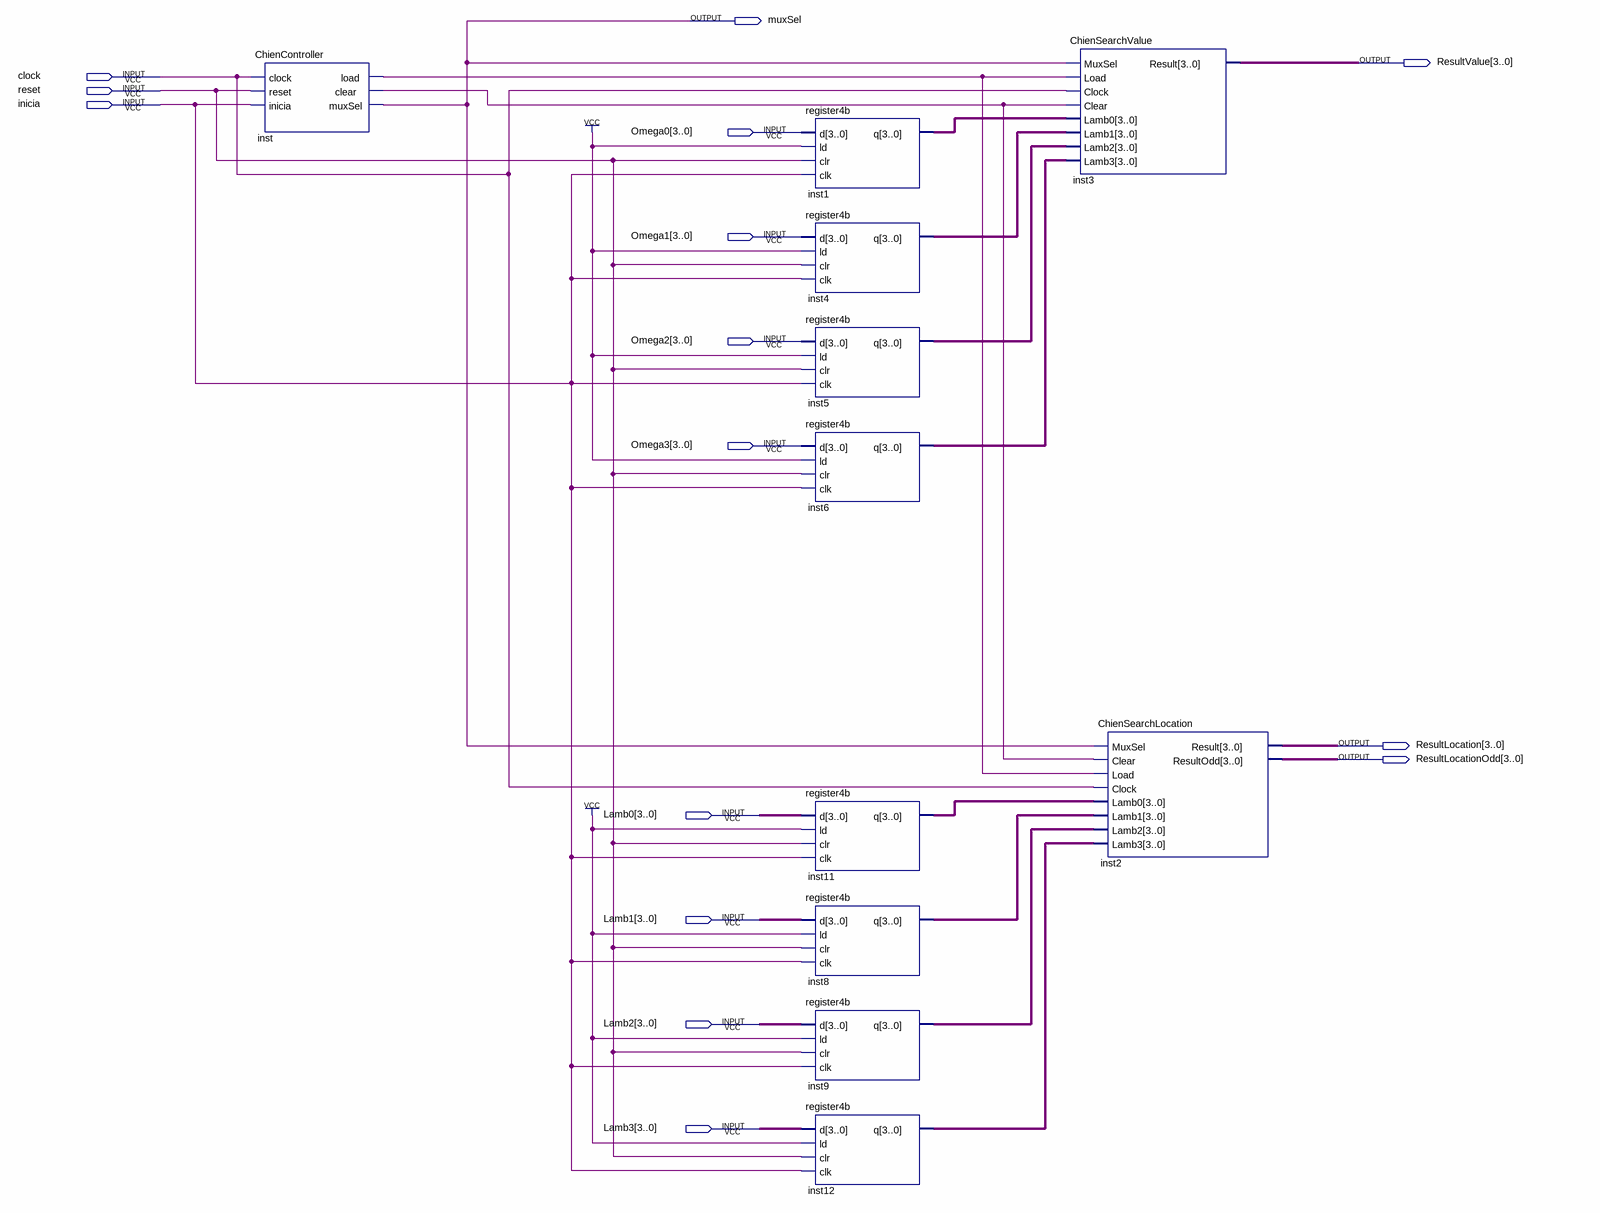
[diagram p0: schematic sheet]
// Quartus schematic Chien.bdf as structural Verilog: 11 symbols, 15 pins
module Chien (
  input  clock,
  input  reset,
  input  inicia,
  input  [3:0] Omega0,
  input  [3:0] Omega1,
  input  [3:0] Omega2,
  input  [3:0] Omega3,
  input  [3:0] Lamb0,
  input  [3:0] Lamb1,
  input  [3:0] Lamb2,
  input  [3:0] Lamb3,
  output muxSel,
  output [3:0] ResultValue,
  output [3:0] ResultLocation,
  output [3:0] ResultLocationOdd
);

  wire inst_clear, inst_load;
  wire [3:0] inst1_q, inst4_q, inst5_q, inst6_q, inst8_q, inst9_q, inst11_q, inst12_q;

  ChienController inst (
    .clock(clock), .reset(reset), .inicia(inicia), .load(inst_load), .clear(inst_clear), .muxSel(muxSel));
  register4b inst1 (.d(Omega0), .ld(1'b1), .clr(reset), .clk(inicia), .q(inst1_q));
  register4b inst4 (.d(Omega1), .ld(1'b1), .clr(reset), .clk(inicia), .q(inst4_q));
  register4b inst5 (.d(Omega2), .ld(1'b1), .clr(reset), .clk(inicia), .q(inst5_q));
  register4b inst6 (.d(Omega3), .ld(1'b1), .clr(reset), .clk(inicia), .q(inst6_q));
  register4b inst11 (.d(Lamb0), .ld(1'b1), .clr(reset), .clk(inicia), .q(inst11_q));
  register4b inst8 (.d(Lamb1), .ld(1'b1), .clr(reset), .clk(inicia), .q(inst8_q));
  register4b inst9 (.d(Lamb2), .ld(1'b1), .clr(reset), .clk(inicia), .q(inst9_q));
  register4b inst12 (.d(Lamb3), .ld(1'b1), .clr(reset), .clk(inicia), .q(inst12_q));
  ChienSearchValue inst3 (
    .MuxSel(muxSel), .Load(inst_load), .Clock(clock), .Clear(inst_clear), .Lamb0(inst1_q), .Lamb1(inst4_q),
    .Lamb2(inst5_q), .Lamb3(inst6_q), .Result(ResultValue));
  ChienSearchLocation inst2 (
    .MuxSel(muxSel), .Clear(inst_clear), .Load(inst_load), .Clock(clock), .Lamb0(inst11_q), .Lamb1(inst8_q),
    .Lamb2(inst9_q), .Lamb3(inst12_q), .Result(ResultLocation), .ResultOdd(ResultLocationOdd));
endmodule
